# EAGLE design pulses_rev2 (EAGLE 7.4.0)
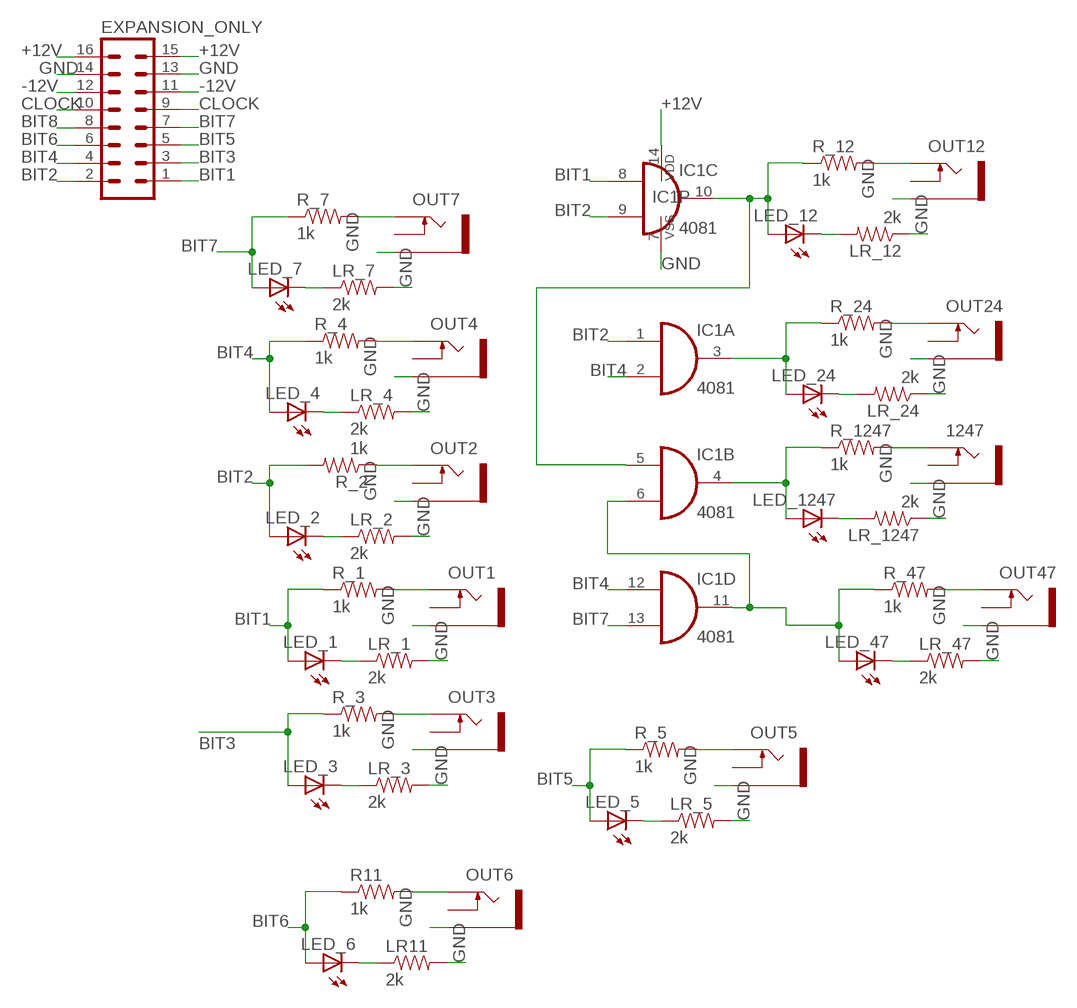
[diagram p0: schematic, sheet 1]

## Parts
1247  THONKICONNNEW  [WQP-PJ301M-12_JACK]
EXPANSION_ONLY  MA08-2  [MA08-2]
IC1  4081  4081D  [SO14]
LED_1  LED3MM  [LED3MM]
LED_2  LED3MM  [LED3MM]
LED_3  LED3MM  [LED3MM]
LED_4  LED3MM  [LED3MM]
LED_5  LED3MM  [LED3MM]
LED_6  LED3MM  [LED3MM]
LED_7  LED3MM  [LED3MM]
LED_12  LED3MM  [LED3MM]
LED_24  LED3MM  [LED3MM]
LED_47  LED3MM  [LED3MM]
LED_1247  LED3MM  [LED3MM]
LR11  2k  RESISTOR1206  [1206]
LR_1  2k  RESISTOR1206  [1206]
LR_2  2k  RESISTOR1206  [1206]
LR_3  2k  RESISTOR1206  [1206]
LR_4  2k  RESISTOR1206  [1206]
LR_5  2k  RESISTOR1206  [1206]
LR_7  2k  RESISTOR1206  [1206]
LR_12  2k  RESISTOR1206  [1206]
LR_24  2k  RESISTOR1206  [1206]
LR_47  2k  RESISTOR1206  [1206]
LR_1247  2k  RESISTOR1206  [1206]
OUT1  THONKICONNNEW  [WQP-PJ301M-12_JACK]
OUT2  THONKICONNNEW  [WQP-PJ301M-12_JACK]
OUT3  THONKICONNNEW  [WQP-PJ301M-12_JACK]
OUT4  THONKICONNNEW  [WQP-PJ301M-12_JACK]
OUT5  THONKICONNNEW  [WQP-PJ301M-12_JACK]
OUT6  THONKICONNNEW  [WQP-PJ301M-12_JACK]
OUT7  THONKICONNNEW  [WQP-PJ301M-12_JACK]
OUT12  THONKICONNNEW  [WQP-PJ301M-12_JACK]
OUT24  THONKICONNNEW  [WQP-PJ301M-12_JACK]
OUT47  THONKICONNNEW  [WQP-PJ301M-12_JACK]
R11  1k  RESISTOR1206  [1206]
R_1  1k  RESISTOR1206  [1206]
R_2  1k  RESISTOR1206  [1206]
R_3  1k  RESISTOR1206  [1206]
R_4  1k  RESISTOR1206  [1206]
R_5  1k  RESISTOR1206  [1206]
R_7  1k  RESISTOR1206  [1206]
R_12  1k  RESISTOR1206  [1206]
R_24  1k  RESISTOR1206  [1206]
R_47  1k  RESISTOR1206  [1206]
R_1247  1k  RESISTOR1206  [1206]

## Nets
+12V [PWR]: EXPANSION_ONLY.15 EXPANSION_ONLY.16 IC1.14(P:VDD)
-12V [PWR]: EXPANSION_ONLY.11 EXPANSION_ONLY.12
BIT1: EXPANSION_ONLY.1 IC1.8(C:I0) LED_1.A R_1.1
BIT2: EXPANSION_ONLY.2 IC1.1(A:I0) IC1.9(C:I1) LED_2.A R_2.2
BIT3: EXPANSION_ONLY.3 LED_3.A R_3.1
BIT4: EXPANSION_ONLY.4 IC1.2(A:I1) IC1.12(D:I0) LED_4.A R_4.1
BIT5: EXPANSION_ONLY.5 LED_5.A R_5.1
BIT6: EXPANSION_ONLY.6 LED_6.A R11.1
BIT7: EXPANSION_ONLY.7 IC1.13(D:I1) LED_7.A R_7.1
BIT8: EXPANSION_ONLY.8
BIT9: IC1.5(B:I0) IC1.10(C:O) LED_12.A R_12.1
BIT10: IC1.3(A:O) LED_24.A R_24.1
BIT11: IC1.4(B:O) LED_1247.A R_1247.1
BIT12: IC1.6(B:I1) IC1.11(D:O) LED_47.A R_47.1
CLOCK: EXPANSION_ONLY.9 EXPANSION_ONLY.10
GND [GND]: 1247.P$3_SLEEVE(SLEEVE) EXPANSION_ONLY.13 EXPANSION_ONLY.14 IC1.7(P:VSS) LR11.2 LR_1.2 LR_2.2 LR_3.2 LR_4.2 LR_5.2 LR_7.2 LR_12.1 LR_24.1 LR_47.2 LR_1247.1 OUT1.P$3_SLEEVE(SLEEVE) OUT2.P$3_SLEEVE(SLEEVE) OUT3.P$3_SLEEVE(SLEEVE) OUT4.P$3_SLEEVE(SLEEVE) OUT5.P$3_SLEEVE(SLEEVE) OUT6.P$3_SLEEVE(SLEEVE) OUT7.P$3_SLEEVE(SLEEVE) OUT12.P$3_SLEEVE(SLEEVE) OUT24.P$3_SLEEVE(SLEEVE) OUT47.P$3_SLEEVE(SLEEVE)
N$1: OUT1.P$1_TIP(TIP) R_1.2
N$2: LED_1.K(C) LR_1.1
N$3: OUT12.P$1_TIP(TIP) R_12.2
N$4: OUT2.P$1_TIP(TIP) R_2.1
N$5: LED_2.K(C) LR_2.1
N$6: LED_12.K(C) LR_12.2
N$7: OUT4.P$1_TIP(TIP) R_4.2
N$8: LED_4.K(C) LR_4.1
N$9: OUT24.P$1_TIP(TIP) R_24.2
N$10: OUT7.P$1_TIP(TIP) R_7.2
N$11: LED_7.K(C) LR_7.1
N$12: LED_24.K(C) LR_24.2
N$13: 1247.P$1_TIP(TIP) R_1247.2
N$14: LED_1247.K(C) LR_1247.2
N$15: OUT3.P$1_TIP(TIP) R_3.2
N$16: OUT47.P$1_TIP(TIP) R_47.2
N$17: LED_47.K(C) LR_47.1
N$18: LED_3.K(C) LR_3.1
N$19: OUT5.P$1_TIP(TIP) R_5.2
N$20: LED_5.K(C) LR_5.1
N$21: OUT6.P$1_TIP(TIP) R11.2
N$22: LED_6.K(C) LR11.1
Unconnected: 1247.P$2_SWITCH(SWITCH) OUT1.P$2_SWITCH(SWITCH) OUT2.P$2_SWITCH(SWITCH) OUT3.P$2_SWITCH(SWITCH) OUT4.P$2_SWITCH(SWITCH) OUT5.P$2_SWITCH(SWITCH) OUT6.P$2_SWITCH(SWITCH) OUT7.P$2_SWITCH(SWITCH) OUT12.P$2_SWITCH(SWITCH) OUT24.P$2_SWITCH(SWITCH) OUT47.P$2_SWITCH(SWITCH)

## Library data of the parts
1247 OUT1-OUT7 OUT12 OUT24 OUT47 = MusicThingModular:THONKICONN: 3.5mm socket for Eurorack modular synths
EXPANSION_ONLY = con-lstb:MA08-2: PIN HEADER; OC_FARNELL: unknown; OC_NEWARK: unknown
IC1 = 40xx:4081: Quad 2-input AND
LED_1-LED_7 LED_12 LED_24 LED_47 LED_1247 = led:LED: LED OSRAM: - CHIPLED LG R971, LG N971, LY N971, LG Q971, LY Q971, LO R971, LY R971 LH N974, LH R974 LS Q976, LO Q976, LY Q976 LO Q996 - Hyper CHIPLED LW Q18S LB Q993, LB Q99A, LB R99A - SideLED LS A670, LO A670, LY A670, LG A670, LP A670 LB A673, LV A673, LT A673, LW A673 LH A674 LY A675 LS A676, LA A676, LO A676, LY A676, LW A676 LS A679, LY A679, LG A679 - Hyper Micro SIDELED® LS Y876, LA Y876, LO Y876, LY Y876 LT Y87S - SmartLED LW L88C, LW L88S LB L89C, LB L89S, LG L890 LS L89K, LO L89K, LY L89K LS L896, LA L896, LO L896, LY L896 - TOPLED LS T670, LO T670, LY T670, LG T670, LP T670 LSG T670, LSP T670, LSY T670, LOP T670, LYG T670 LG T671, LOG T671, LSG T671 LB T673, LV T673, LT T673, LW T673 LH T674 LS T676, LA T676, LO T676, LY T676, LB T676, LH T676, LSB T676, LW T676 LB T67C, LV T67C, LT T67C, LS T67K, LO T67K, LY T67K, LW E67C LS E67B, LA E67B, LO E67B, LY E67B, LB E67C, LV E67C, LT E67C LW T67C LS T679, LY T679, LG T679 LS T770, LO T770, LY T770, LG T770, LP T770 LB T773, LV T773, LT T773, LW T773 LH T774 LS E675, LA E675, LY E675, LS T675 LS T776, LA T776, LO T776, LY T776, LB T776 LHGB T686 LT T68C, LB T68C - Hyper Mini TOPLED® LB M676 - Mini TOPLED Santana® LG M470 LS M47K, LO M47K, LY M47K Source: http://www.osram.convergy.de LUXEON: - LUMILED® LXK2-PW12-R00, LXK2-PW12-S00, LXK2-PW14-U00, LXK2-PW14-V00 LXK2-PM12-R00, LXK2-PM12-S00, LXK2-PM14-U00 LXK2-PE12-Q00, LXK2-PE12-R00, LXK2-PE12-S00, LXK2-PE14-T00, LXK2-PE14-U00 LXK2-PB12-K00, LXK2-PB12-L00, LXK2-PB12-M00, LXK2-PB14-N00, LXK2-PB14-P00, LXK2-PB14-Q00 LXK2-PR12-L00, LXK2-PR12-M00, LXK2-PR14-Q00, LXK2-PR14-R00 LXK2-PD12-Q00, LXK2-PD12-R00, LXK2-PD12-S00 LXK2-PH12-R00, LXK2-PH12-S00 LXK2-PL12-P00, LXK2-PL12-Q00, LXK2-PL12-R00 Source: www.luxeon.com KINGBRIGHT: KA-3528ASYC Source: www.kingbright.com
LR11 LR_1-LR_5 LR_7 LR_12 LR_24 LR_47 LR_1247 R11 R_1-R_5 R_7 R_12 R_24 R_47 R_1247 = SparkFun-Passives:RESISTOR: Resistor Basic schematic elements and footprints for 0603, 1206, and PTH resistors.

## Net classes
0 default: width 0.203 mm
1 GND: width 0.203 mm
2 PWR: width 0.203 mm

## Board
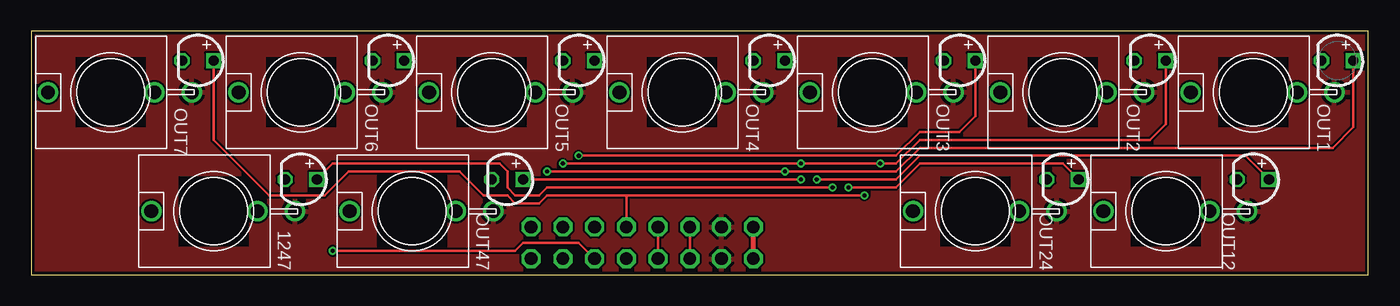
[diagram p1: board, top side]
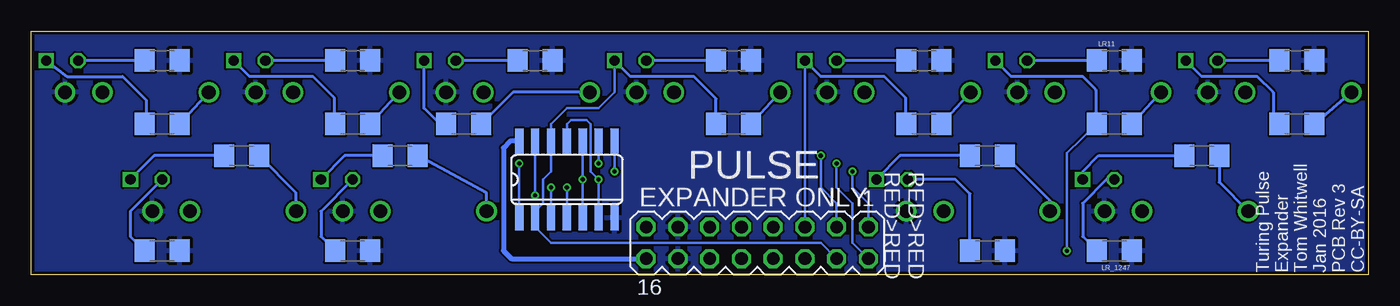
[diagram p2: board, bottom side, seen from below]

Size 107 x 19.5 mm. Coordinates in mm from the lower left corner, seen from the top.
Outline: 0,0 107,0 107,19.5 0,19.5 0,0
Copper layers (1*2*15*16): Top 0.035mm / dielectric 0.2mm / Route2 0.0175mm / dielectric 1.1mm / Route15 0.0175mm / dielectric 0.2mm / Bottom 0.035mm
Design rules "SeeedStudio_DRU_no_angle_20130527": minimum track width 6mil, minimum drill 12mil, track to track 6mil, track to pad 6mil, pad to pad 6mil, via to via 6mil, smd to smd 0mil, copper to edge 10mil, drill to drill 10mil, minimum pad ring 6mil, minimum via ring 6mil, stop-mask expansion 2mil, vias tented up to drill 25mil, thermal gap 10mil

### Footprints (pad centres in the part's own frame; a part is rotated, then mirrored left to right if it is on the bottom)
WQP-PJ301M-12_JACK = drill 1.1: P$1_TIP 0,5; P$2_SWITCH 0,-3.5; P$3_SLEEVE 0,-6.5
MA08-2 = drill 1.016 octagon: 1 -8.89,-1.27; 2 -8.89,1.27; 3 -6.35,-1.27; 4 -6.35,1.27; 5 -3.81,-1.27; 6 -3.81,1.27; 7 -1.27,-1.27; 8 -1.27,1.27; 9 1.27,-1.27; 10 1.27,1.27; 11 3.81,-1.27; 12 3.81,1.27; 13 6.35,-1.27; 14 6.35,1.27; 15 8.89,-1.27; 16 8.89,1.27
SO14 = smd 0.66 x 2.032: 1 -3.81,-3.073; 2 -2.54,-3.073; 3 -1.27,-3.073; 4 0,-3.073; 5 1.27,-3.073; 6 2.54,-3.073; 7 3.81,-3.073; 8 3.81,3.073; 9 2.54,3.073; 10 1.27,3.073; 11 0,3.073; 12 -1.27,3.073; 13 -2.54,3.073; 14 -3.81,3.073
LED3MM = drill 0.813 square: A -1.27,0 | drill 0.813 octagon: K 1.27,0
1206 = smd 1.6 x 1.8: 1 -1.4,0; 2 1.4,0

### Placement (x,y rotation side)
1247  14.61,5.08 90 top
EXPANSION_ONLY  48.9,2.54 180 bottom
IC1  64.14,7.62 0 bottom
LED_1  104.52,17.14 180 top
LED_2  89.53,17.14 180 top
LED_3  74.3,17.14 180 top
LED_4  59.05,17.14 180 top
LED_5  43.81,17.14 180 top
LED_6  28.57,17.14 180 top
LED_7  13.34,17.14 180 top
LED_12  97.79,7.62 180 top
LED_24  82.55,7.62 180 top
LED_47  38.1,7.62 180 top
LED_1247  21.59,7.62 180 top
LR11  20.32,17.14 0 bottom
LR_1  96.52,17.14 0 bottom
LR_2  81.28,17.14 0 bottom
LR_3  66.67,17.14 0 bottom
LR_4  50.8,17.14 0 bottom
LR_5  35.56,17.14 0 bottom
LR_7  5.71,17.14 0 bottom
LR_12  96.52,1.91 180 bottom
LR_24  81.28,1.91 180 bottom
LR_47  30.48,1.91 0 bottom
LR_1247  20.32,1.91 180 bottom
OUT1  97.79,14.61 90 top
OUT2  82.55,14.61 90 top
OUT3  67.31,14.61 90 top
OUT4  52.07,14.61 90 top
OUT5  36.83,14.61 90 top
OUT6  21.59,14.61 90 top
OUT7  6.35,14.61 90 top
OUT12  90.81,5.08 90 top
OUT24  75.56,5.08 90 top
OUT47  30.48,5.08 90 top
R11  20.32,12.06 0 bottom
R_1  96.52,12.06 0 bottom
R_2  81.28,12.06 180 bottom
R_3  72.39,12.06 0 bottom
R_4  50.8,12.06 0 bottom
R_5  35.56,12.06 0 bottom
R_7  5.71,12.06 0 bottom
R_12  90.17,9.53 0 bottom
R_24  77.47,9.53 0 bottom
R_47  30.48,9.53 0 bottom
R_1247  13.34,9.53 0 bottom

### Tracks (layer width: path | path; a pad name or v marks a point on that pad's centre or on a via)
+12V
  Top 0.406: EXPANSION_ONLY.16 EXPANSION_ONLY.15
  Bottom 0.406: IC1.14 68.68,10.69 69.22,10.16 69.22,1.91 68.58,1.27 EXPANSION_ONLY.16
-12V
  Top 0.203: EXPANSION_ONLY.12 EXPANSION_ONLY.11
BIT1  (via drill 0.33)
  Top 0.203: LED_1.A 105.79,11.81 104.14,10.16 71.12,10.16 69.22,8.26 v60.33,8.26 v41.27,8.26
  Bottom 0.203: IC1.8 v60.33,8.26 | EXPANSION_ONLY.1 40.01,5.71 41.27,6.99 v41.27,8.26
  Bottom 0.254: LED_1.A 104.14,15.88 99.69,15.88 97.79,13.97 97.79,12.2 R_1.1
BIT2  (via drill 0.33)
  Top 0.203: LED_2.A 90.81,12.06 89.53,10.79 71.12,10.79 69.22,8.89 v67.94,8.89 v61.59,8.89 v42.55,8.89
  Bottom 0.203: IC1.1 v67.94,8.89 | IC1.9 v61.59,8.89 | EXPANSION_ONLY.2 41.27,2.54 41.27,5.71 42.55,6.99 v42.55,8.89
  Bottom 0.254: LED_2.A 89.53,15.88 84.45,15.88 82.77,14.19 82.77,12.15 R_2.2
BIT3  (via drill 0.33)
  Top 0.203: LED_3.A 75.56,12.7 74.3,11.43 71.12,11.43 69.22,9.53 v43.81,9.53
  Bottom 0.203: EXPANSION_ONLY.3 42.55,5.71 43.81,6.99 v43.81,9.53
  Bottom 0.254: R_3.1 74.3,12.06 75.56,13.34 LED_3.A
BIT4
  Bottom 0.203: LED_4.A 60.33,14.61 61.59,13.34 64.14,13.34 65.41,12.06 IC1.12 65.41,8.26 66.04,7.62 66.04,5.71 66.67,5.08 IC1.2 66.67,3.81 65.41,2.54 43.81,2.54 EXPANSION_ONLY.4
  Bottom 0.254: R_4.1 52.2,14.1 53.98,15.88 59.05,15.88 LED_4.A
BIT5
  Bottom 0.203: EXPANSION_ONLY.5 LED_5.A
  Bottom 0.254: LED_5.A 43.81,15.88 38.73,15.88 37.05,14.19 37.05,12.15 R_5.1
BIT6  (via drill 0.33)
  Top 0.203: EXPANSION_ONLY.6 43.81,2.54 39.37,2.54 38.73,1.91 v24.13,1.91
  Bottom 0.203: v24.13,1.91 24.13,9.74 R11.1
  Bottom 0.254: LED_6.A 28.57,15.88 22.86,15.88 21.8,14.82 21.8,12.15 R11.1
BIT7  (via drill 0.33)
  Top 0.203: EXPANSION_ONLY.7 47.62,6.35 | 47.62,6.35 v66.67,6.35 | LED_7.A 14.61,10.79 19.05,6.35 23.5,6.35 25.4,8.26 34.29,8.26 36.2,6.35 38.1,6.35 38.73,5.71 40.64,5.71 41.27,6.35 47.62,6.35
  Bottom 0.203: IC1.13 v66.67,6.35 | 7.62,12.57 R_7.1
  Bottom 0.254: LED_7.A 13.34,15.88 8.89,15.88 7.62,14.61 7.62,12.57
BIT9  (via drill 0.33)
  Top 0.203: LED_12.A 97.16,9.53 71.12,9.53 69.22,7.62 v62.87,7.62
  Bottom 0.203: IC1.10 v62.87,7.62 IC1.5
  Bottom 0.254: R_12.1 97.16,9.53 LED_12.A
BIT10  (via drill 0.33)
  Top 0.203: LED_24.A 82.55,8.89 71.12,8.89 69.22,6.99 v65.41,6.99
  Bottom 0.203: IC1.3 v65.41,6.99
  Bottom 0.254: R_24.1 81.92,9.53 LED_24.A
BIT11  (via drill 0.33)
  Top 0.203: v64.14,6.99 41.27,6.99 40.64,6.35 38.73,6.35 38.1,6.99 38.1,8.26 37.47,8.89 24.13,8.89 LED_1247.A
  Bottom 0.203: IC1.4 v64.14,6.99
  Bottom 0.254: LED_1247.A 22.86,8.26 21.59,9.53 R_1247.1
BIT12  (via drill 0.33)
  Top 0.203: LED_47.A v61.59,7.62
  Bottom 0.203: IC1.6 v61.59,7.62 62.23,8.26 62.23,12.06 62.55,12.38 63.82,12.38 64.14,12.06 IC1.11
  Bottom 0.254: R_47.1 37.47,9.53 LED_47.A
CLOCK
  Top 0.203: EXPANSION_ONLY.10 EXPANSION_ONLY.9
GND
  pour Bottom: -1.27,0 -1.27,21.59 107.95,21.59 107.95,0
  pour Top: -0.64,20.32 106.68,20.32 107.31,-0.64 -0.64,-0.64
N$1
  Bottom 0.254: OUT1.P$1_TIP R_1.2
N$2
  Bottom 0.254: LR_1.1 LED_1.K
N$3
  Bottom 0.254: OUT12.P$1_TIP 85.81,6.56 R_12.2
N$4
  Bottom 0.254: OUT2.P$1_TIP R_2.1
N$5
  Bottom 0.254: LR_2.1 LED_2.K
N$6
  Bottom 0.254: LED_12.K 99.06,5.08 99.06,3.04 LR_12.2
N$7
  Bottom 0.254: OUT4.P$1_TIP R_4.2
N$8
  Bottom 0.254: LR_4.1 LED_4.K
N$9
  Bottom 0.254: OUT24.P$1_TIP 70.56,6.56 R_24.2
N$10
  Bottom 0.254: OUT7.P$1_TIP R_7.2
N$11
  Bottom 0.254: LR_7.1 LED_7.K
N$12
  Bottom 0.254: LED_24.K 83.82,5.08 83.82,3.04 LR_24.2
N$13
  Bottom 0.254: R_1247.2 11.94,7.41 1247.P$1_TIP
N$14
  Bottom 0.254: LED_1247.K 20.95,7.62 22.86,5.71 22.86,3.04 LR_1247.2
N$15
  Bottom 0.254: OUT3.P$1_TIP 68.45,14.61 R_3.2
N$16
  Bottom 0.254: OUT47.P$1_TIP 25.48,5.92 R_47.2
N$17
  Bottom 0.254: LR_47.1 31.88,6.48 33.02,7.62 LED_47.K
N$18
  Bottom 0.254: LR_3.1 LED_3.K
N$19
  Bottom 0.254: OUT5.P$1_TIP R_5.2
N$20
  Bottom 0.254: LR_5.1 LED_5.K
N$21
  Bottom 0.254: OUT6.P$1_TIP R11.2
N$22
  Bottom 0.254: LR11.1 LED_6.K

### Text on the board
bPlace: PULSE | RED>RED / RED>RED | EXPANDER ONLY | Turing Pulse / Expander / Tom Whitwell / Jan 2016 / PCB Rev 3 / CC-BY-SA
bValues: 1k / Resistors | All the / others / 2k LED / resistors